# Altium schematic sheet Power.SchDoc
size A
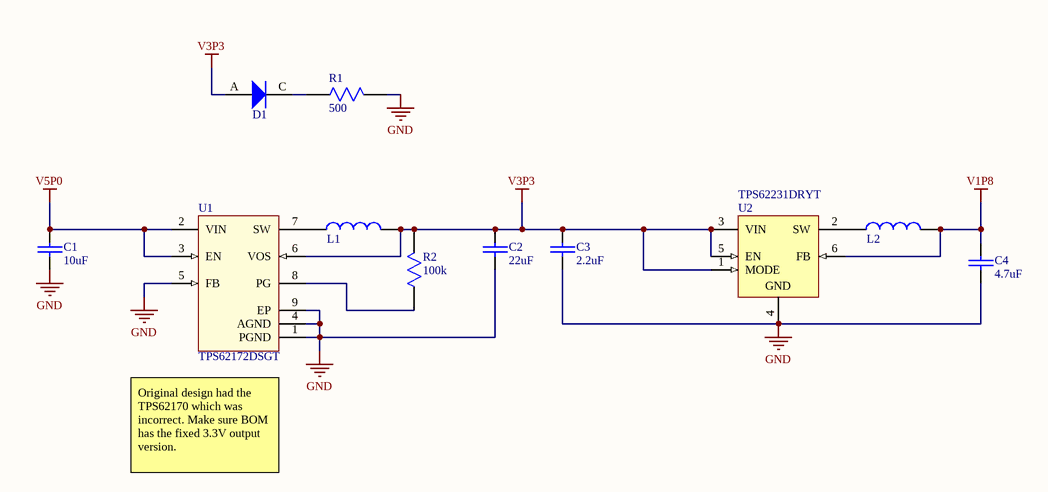
[diagram p0: Power.SchDoc]

## Parts
C1  10uF  [SMD Capacitor 0603]
C2  22uF  [SMD Capacitor 0603]
C3  2.2uF  [SMD CAP 0402]
C4  4.7uF  [SMD CAP 0402]
D1  LED 0603  [LED_0603]  (value not drawn)
L1  Ferrite Bead  [LQM21PN2R2MC0D]  (value not drawn)
L2  Ferrite Bead  [LQM21PN2R2MC0D]  (value not drawn)
R1  500  [SMD RES 0402]
R2  100k  [SMD RES 0402]
U1  TPS62172DSGT  [DSG8-1600X900TP]
U2  TPS62231DRYT  [DRY6]

## Nets
GND: C1.1 C2.1 C3.1 C4.1 R1.1 U1.1(PGND) U1.4(AGND) U1.5(FB) U1.9(EP) U2.4(GND)
V1P8: C4.0 L2.2 U2.6(FB)
V3P3: C2.0 C3.0 D1.A L1.2 R2.1 U1.6(VOS) U2.1(MODE) U2.3(VIN) U2.5(EN)
V5P0: C1.0 U1.2(VIN) U1.3(EN)
NetD1_C: D1.C R1.0
NetL1_1: L1.1 U1.7(SW)
NetL2_1: L2.1 U2.2(SW)
NetR2_0: R2.0 U1.8(PG)

## Notes on the sheet
- (near U1) Original design had the TPS62170 which was incorrect. Make sure BOM has the fixed 3.3V output version.

## Library data of the parts
C1-C4 = Capacitor: Value: C?
D1 = LED 0603: LTST_C195TBJRKT
R1 R2 = Resistor: Value: ?
U1 = TPS62170DSGT: Buck Step Down Regulator with 3 to 17 V Input and 0.9 to 6 V Output, -40 to 85 degC, 8-Pin WSON (DSG), Green (RoHS & no Sb/Br); Manufacturer: Texas Instruments; Duty Cycle(Max)(%): 100; Iout(Max)(A): 0.5; Iq(Typ)(mA): 0.017; Rating: Catalog; Regulated Outputs(#): 1; SubFamily: Step-Down Regulator; Switch Current Limit(Typ)(A): 1.05; Synchronous Rectification: TRUE; Vin(Max)(V): 17; Vin(Min)(V): 3; Vout(Max)(V): 6; Vout(Min)(V): 0.9; DatasheetVersion: SLVSAT8A; PackageVersion: revB, Oct-2010; PackageReference: DSG8-1600X900TP; PackageDescription: 8-Pin Plastic Small Outline No-Lead, 2 x 2 x 0.8 mm Body, 0.5 mm Pitch, Exposed Pad; Supplier 1: Digi-Key; Supplier Part Number 1: 296-30229-2-ND; Supplier 2: Digi-Key; Supplier Part Number 2: 296-30229-1-ND; Supplier 3: Digi-Key; Supplier Part Number 3: 296-30229-6-ND; Supplier 4: Newark; Supplier Part Number 4: 74T5562; Supplier 5: Mouser; Supplier Part Number 5: 595-TPS62170DSGT; Eco-Plan: Green (RoHS & no Sb/Br); Topology: Buck; Mounting Technology: Surface Mount; Code_JEDEC: MO-229; PartNumber: TPS62170DSGT; ComponentLink1Description: Datasheet; ComponentLink1URL: http://www.ti.com/general/docs/lit/getliterature.tsp?genericPartNumber=TPS62170&fileType=pdf; ComponentLink2Description: Package Specification; ComponentLink2URL: http://www.ti.com/litv/pdf/mpds308a; ComponentLink3Description: URL Link1; ComponentLink3URL: Samples URL:http://www.ti.com/product/tps54611#samples
U2 = TPS62231DRYT: Buck Step Down Regulator with 2.05 to 6 V Input and 1.8 V Output, -40 to 85 degC, 6-Pin SON (DRY), Green (RoHS & no Sb/Br); Manufacturer: Texas Instruments; Duty Cycle(Max)(%): 100; Iout(Max)(A): 0.5; Iq(Typ)(mA): 0.022; Preset Vout(V): 1.8; Rating: Catalog; Regulated Outputs(#): 1; SubFamily: Step-Down Regulator; Switch Current Limit(Typ)(A): 0.84; Synchronous Rectification: TRUE; Vin(Max)(V): 6; Vin(Min)(V): 2.05; DatasheetVersion: SLVS941E; PackageVersion: revF, Dec-2011; PackageReference: DRY6; PackageDescription: 6-Pin Plastic Small Outline No-Lead, 1 x 1.45 x 0.6 mm Body, 0.5 mm Pitch; Supplier 1: Digi-Key; Supplier Part Number 1: 296-24485-2-ND; Supplier 2: Digi-Key; Supplier Part Number 2: 296-24485-1-ND; Supplier 3: Digi-Key; Supplier Part Number 3: 296-24485-6-ND; Supplier 4: Farnell; Supplier Part Number 4: 1735598; Supplier 5: Newark; Supplier Part Number 5: 07R8108; Supplier 6: Mouser; Supplier Part Number 6: 595-TPS62231DRYT; Eco-Plan: Green (RoHS & no Sb/Br); Topology: Buck; Vout(Max)(V): 1.8; Vout(Min)(V): 1.8; Mounting Technology: Surface Mount; PartNumber: TPS62231DRYT; ComponentLink1Description: Datasheet; ComponentLink1URL: http://www.ti.com/general/docs/lit/getliterature.tsp?genericPartNumber=TPS62231&fileType=pdf; ComponentLink2Description: Package Specification; ComponentLink2URL: http://www.ti.com/litv/pdf/mpds221e; ComponentLink3Description: URL Link1; ComponentLink3URL: Samples URL:http://www.ti.com/product/tps62231#samples